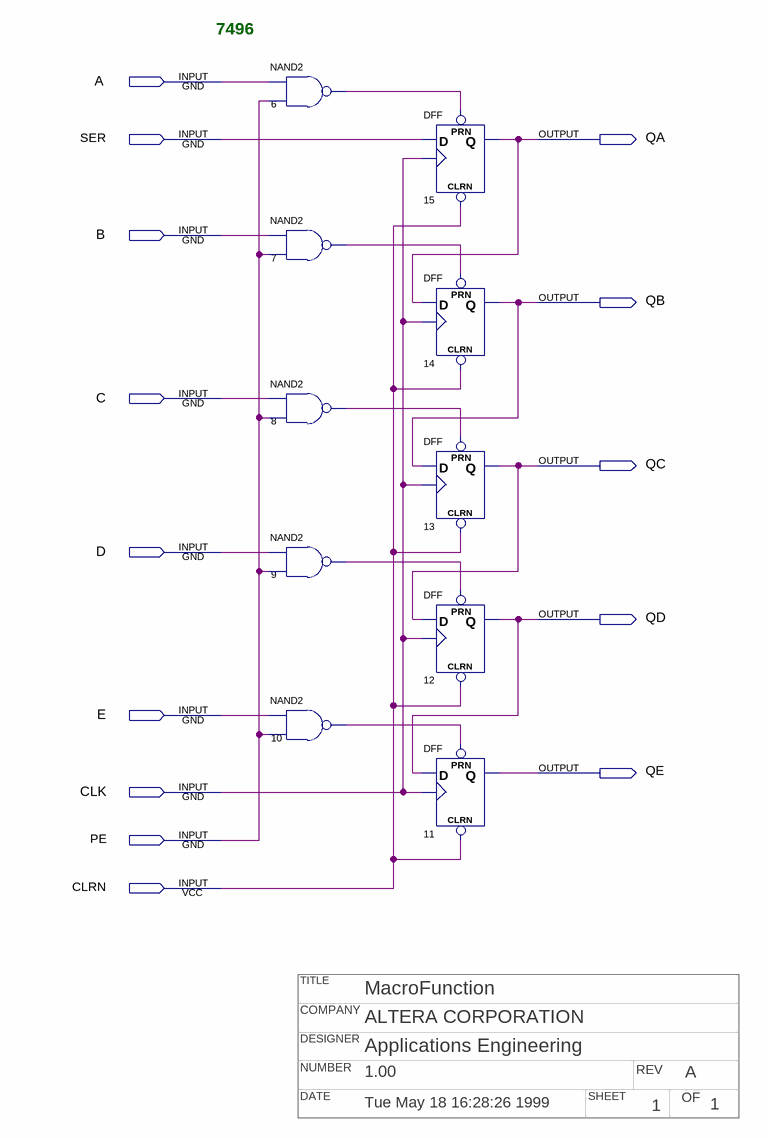
[diagram p0: schematic sheet]
// Quartus schematic 7496.bdf as structural Verilog: 10 symbols, 14 pins
// Title block: TITLE: MacroFunction; COMPANY: ALTERA CORPORATION; DESIGNER: Applications Engineering; NUMBER: 1.00; REV: A; DATE: Tue May 18 16:28:26 1999; SHEET: 1; OF: 1
module \7496  (
  input  A,
  input  SER,
  input  B,
  input  C,
  input  D,
  input  E,
  input  CLK,
  input  PE,
  input  CLRN,
  output QA,
  output QB,
  output QC,
  output QD,
  output QE
);

  wire n6_out, n7_out, n8_out, n9_out, n10_out;

  nand u_6 (n6_out, A, PE);
  nand u_7 (n7_out, B, PE);
  nand u_8 (n8_out, C, PE);
  nand u_9 (n9_out, D, PE);
  nand u_10 (n10_out, E, PE);
  DFF u_15 (.CLRN(CLRN), .CLK(CLK), .D(SER), .PRN(n6_out), .Q(QA));
  DFF u_14 (.CLRN(CLRN), .CLK(CLK), .D(QA), .PRN(n7_out), .Q(QB));
  DFF u_13 (.CLRN(CLRN), .CLK(CLK), .D(QB), .PRN(n8_out), .Q(QC));
  DFF u_12 (.CLRN(CLRN), .CLK(CLK), .D(QC), .PRN(n9_out), .Q(QD));
  DFF u_11 (.CLRN(CLRN), .CLK(CLK), .D(QD), .PRN(n10_out), .Q(QE));

  // Notes on the sheet:
  //   7496
endmodule
